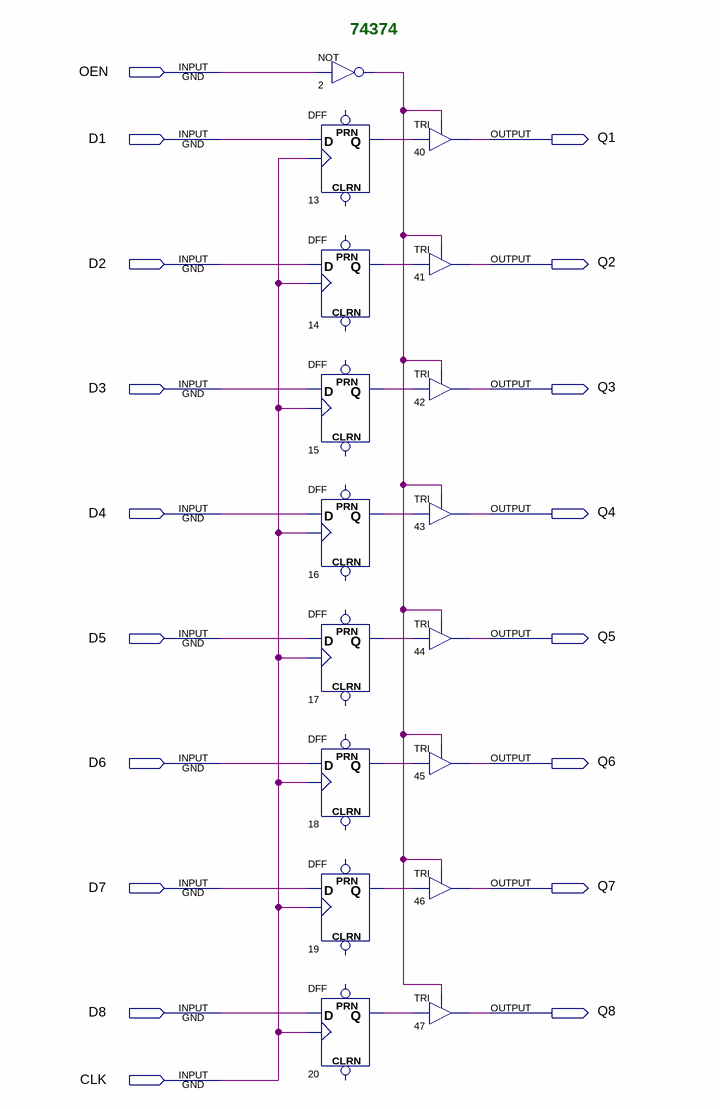
[diagram p0: schematic sheet]
// Quartus schematic HC74374.bdf as structural Verilog: 17 symbols, 18 pins
module HC74374 (
  input  OEN,
  input  D1,
  input  D2,
  input  D3,
  input  D4,
  input  D5,
  input  D6,
  input  D7,
  input  D8,
  input  CLK,
  output Q1,
  output Q2,
  output Q3,
  output Q4,
  output Q5,
  output Q6,
  output Q7,
  output Q8
);

  wire n2_out, n13_q, n14_q, n15_q, n16_q, n17_q, n18_q, n19_q, n20_q;

  not u_2 (n2_out, OEN);
  DFF u_13 (.CLK(CLK), .D(D1), .Q(n13_q));  // open: CLRN, PRN
  DFF u_14 (.CLK(CLK), .D(D2), .Q(n14_q));  // open: CLRN, PRN
  DFF u_15 (.CLK(CLK), .D(D3), .Q(n15_q));  // open: CLRN, PRN
  DFF u_16 (.CLK(CLK), .D(D4), .Q(n16_q));  // open: CLRN, PRN
  DFF u_17 (.CLK(CLK), .D(D5), .Q(n17_q));  // open: CLRN, PRN
  DFF u_18 (.CLK(CLK), .D(D6), .Q(n18_q));  // open: CLRN, PRN
  DFF u_19 (.CLK(CLK), .D(D7), .Q(n19_q));  // open: CLRN, PRN
  DFF u_20 (.CLK(CLK), .D(D8), .Q(n20_q));  // open: CLRN, PRN
  TRI u_40 (.IN(n13_q), .OE(n2_out), .OUT(Q1));
  TRI u_41 (.IN(n14_q), .OE(n2_out), .OUT(Q2));
  TRI u_42 (.IN(n15_q), .OE(n2_out), .OUT(Q3));
  TRI u_43 (.IN(n16_q), .OE(n2_out), .OUT(Q4));
  TRI u_44 (.IN(n17_q), .OE(n2_out), .OUT(Q5));
  TRI u_45 (.IN(n18_q), .OE(n2_out), .OUT(Q6));
  TRI u_46 (.IN(n19_q), .OE(n2_out), .OUT(Q7));
  TRI u_47 (.IN(n20_q), .OE(n2_out), .OUT(Q8));

  // Notes on the sheet:
  //   74374
endmodule
